# Altium project Carte suiveur ligne.PrjPcb
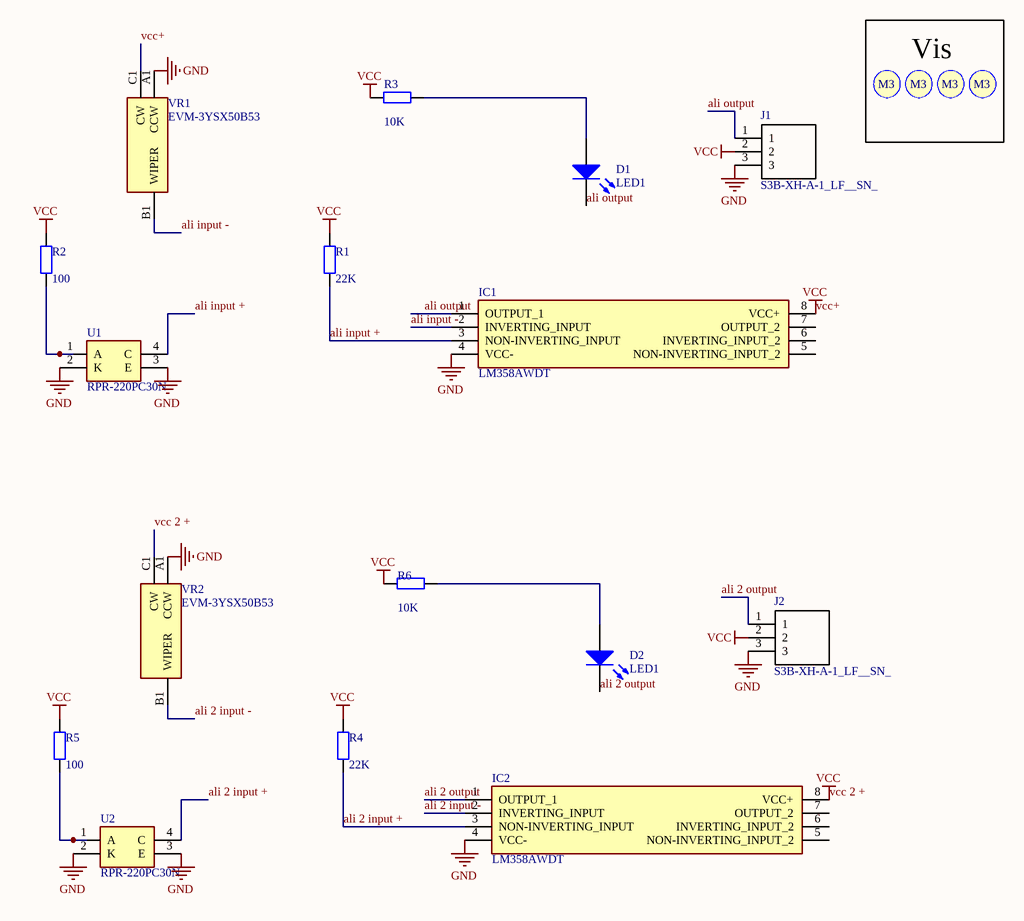
[diagram p0: Schémas suiveur ligne.SchDoc]
1 sheet, 20 parts. Net scope: global (net labels, ports and power ports of the same name join across sheets).
Board file: Schémas suiveur ligne.PcbDoc

## Sheet Schémas suiveur ligne.SchDoc
size A4; SheetNumber: 1; SheetTotal: 1; SPICEModelCacheTERYELQT: <root> / <DocumentId>TERYELQT</DocumentId> / <CacheFrame Number="0"> / <Model Name="led1" Kind="MDL"> / <Text>*Typ RED GaAs LED: Vf=1.7V Vr=4V If=40mA trr=3uS / *LED Pinout: 1=A, 2=K / .MODEL LED1 D (IS=93.2P RS=42M N=3.73 BV=4 IBV=10U / + CJO=2.97P VJ=.75 M=.333 TT=4.32U)</Text> / </Model> / </CacheFrame> / </root>

### Parts
D1  LED1  [KP-3216SEC]
D2  LED1  [KP-3216SEC]
IC1  LM358AWDT  [SOIC127P600X175-8N]
IC2  LM358AWDT  [SOIC127P600X175-8N]
J1  S3B-XH-A-1_LF__SN_  [S3B-XH-A]
J2  S3B-XH-A-1_LF__SN_  [S3B-XH-A]
R1  value 22K  [Resistor 1206]
R2  value 100  [Resistor 1206]
R3  value 10K  [Resistor 1206]
R4  value 22K  [Resistor 1206]
R5  value 100  [Resistor 1206]
R6  value 10K  [Resistor 1206]
S1  Screw M3  [Screw M3]  (value not drawn)
S2  Screw M3  [Screw M3]  (value not drawn)
S3  Screw M3  [Screw M3]  (value not drawn)
S4  Screw M3  [Screw M3]  (value not drawn)
U1  RPR-220PC30N  [RPR220PC30N]
U2  RPR-220PC30N  [RPR220PC30N]
VR1  EVM-3YSX50B53  [EVM3YSX50B53]
VR2  EVM-3YSX50B53  [EVM3YSX50B53]

### Nets
GND: IC1.4(VCC-) IC2.4(VCC-) J1.3 J2.3 U1.2(K) U1.3(E) U2.2(K) U2.3(E) VR1.A1(CCW) VR2.A1(CCW)
vcc 2 +: IC1.8(VCC+) IC2.8(VCC+) J1.2 J2.2 R1.2 R2.2 R3.2 R4.2 R5.2 R6.2 VR1.C1(CW) VR2.C1(CW)  [also labelled VCC, vcc+]
ali 2 input +: IC2.3(NON-INVERTING_INPUT) R4.1 U2.4(C)
ali 2 input -: IC2.2(INVERTING_INPUT) VR2.B1(WIPER)
ali 2 output: D2.2(K) IC2.1(OUTPUT_1) J2.1
ali input +: IC1.3(NON-INVERTING_INPUT) R1.1 U1.4(C)
ali input -: IC1.2(INVERTING_INPUT) VR1.B1(WIPER)
ali output: D1.2(K) IC1.1(OUTPUT_1) J1.1
NetD1_1: D1.1(A) R3.1
NetD2_1: D2.1(A) R6.1
NetR2_1: R2.1 U1.1(A)
NetR5_1: R5.1 U2.1(A)

Not connected (* = marked no-connect by the designer): IC1 5(NON-INVERTING_INPUT_2) 6(INVERTING_INPUT_2) 7(OUTPUT_2); IC2 5(NON-INVERTING_INPUT_2) 6(INVERTING_INPUT_2) 7(OUTPUT_2)

### Notes on the sheet
- Vis
- (in symbol Screw M3) M3

### Library data of the parts
D1 D2 = LED1: Typical RED GaAs LED; Published: 8-Jun-2000; LatestRevisionDate: 08-Jul-2005; LatestRevisionNote: Mech Layer 1 removed.; PackageReference: LED-1; Publisher: Altium Limited; PackageDescription: LED; 2 Leads
IC1 IC2 = LM358AWDT: Integrated Circuit; Manufacturer_Name: STMicroelectronics; Datasheet Link: https://www.st.com/resource/en/datasheet/lm158w.pdf; Height: 1.75mm; Manufacturer_Part_Number: LM358AWDT; Mouser Part Number: 511-LM358AWDT; Mouser Price/Stock: https://www.mouser.co.uk/ProductDetail/STMicroelectronics/LM358AWDT?qs=Ok1pvOkw6%2FqiXfQzFpuZ5Q%3D%3D; Arrow Part Number: LM358AWDT; Arrow Price/Stock: https://www.arrow.com/en/products/lm358awdt/stmicroelectronics?region=nac
J1 J2 = S3B-XH-A-1_LF__SN_: Connector; Manufacturer_Name: JST Sales America; Manufacturer_Part_Number: S3B-XH-A-1(LF)(SN); Datasheet Link: http://www.jst-mfg.com/product/pdf/eng/eXH.pdf?5de523f84a15d; Height: 6.1mm; Arrow Part Number: S3B-XH-A-1(LF)(SN)
R1-R6 = Res2: Resistor; Published: 8-Jun-2000; LatestRevisionDate: 17-Jul-2002; LatestRevisionNote: Re-released for DXP Platform.; PackageReference: AXIAL-0.4; Publisher: Altium Limited; PackageDescription: Axial Device, Thru-Hole; 2 Leads; 0.4 in Pin Spacing
U1 U2 = RPR-220PC30N: Undefined or Miscellaneous; Manufacturer_Name: ROHM Semiconductor; Datasheet Link: http://rohmfs.rohm.com/en/products/databook/datasheet/opto/optical_sensor/photosensor/rpr-220pc30n.pdf; Height: 6.5mm; Manufacturer_Part_Number: RPR-220PC30N; Mouser Part Number: 755-RPR-220PC30N; Mouser Price/Stock: https://www.mouser.co.uk/ProductDetail/ROHM-Semiconductor/RPR-220PC30N?qs=U%2FDGNQcZ28ppQpuQ5bm7oA%3D%3D; Arrow Part Number: RPR-220PC30N; Arrow Price/Stock: https://www.arrow.com/en/products/rpr-220pc30n/rohm-semiconductor
VR1 VR2 = EVM-3YSX50B53: Variable Resistor; Manufacturer_Name: Panasonic; Datasheet Link: https://datasheet.datasheetarchive.com/originals/distributors/Datasheets_SAMA/06485c698e59114aa7d87e0e45252d0d.pdf; Height: 1.55mm; Manufacturer_Part_Number: EVM-3YSX50B53; Mouser Part Number: 667-EVM-3YSX50B53; Mouser Price/Stock: https://www.mouser.com/Search/Refine.aspx?Keyword=667-EVM-3YSX50B53; Arrow Part Number: EVM-3YSX50B53; Arrow Price/Stock: https://www.arrow.com/en/products/evm-3ysx50b53/panasonic